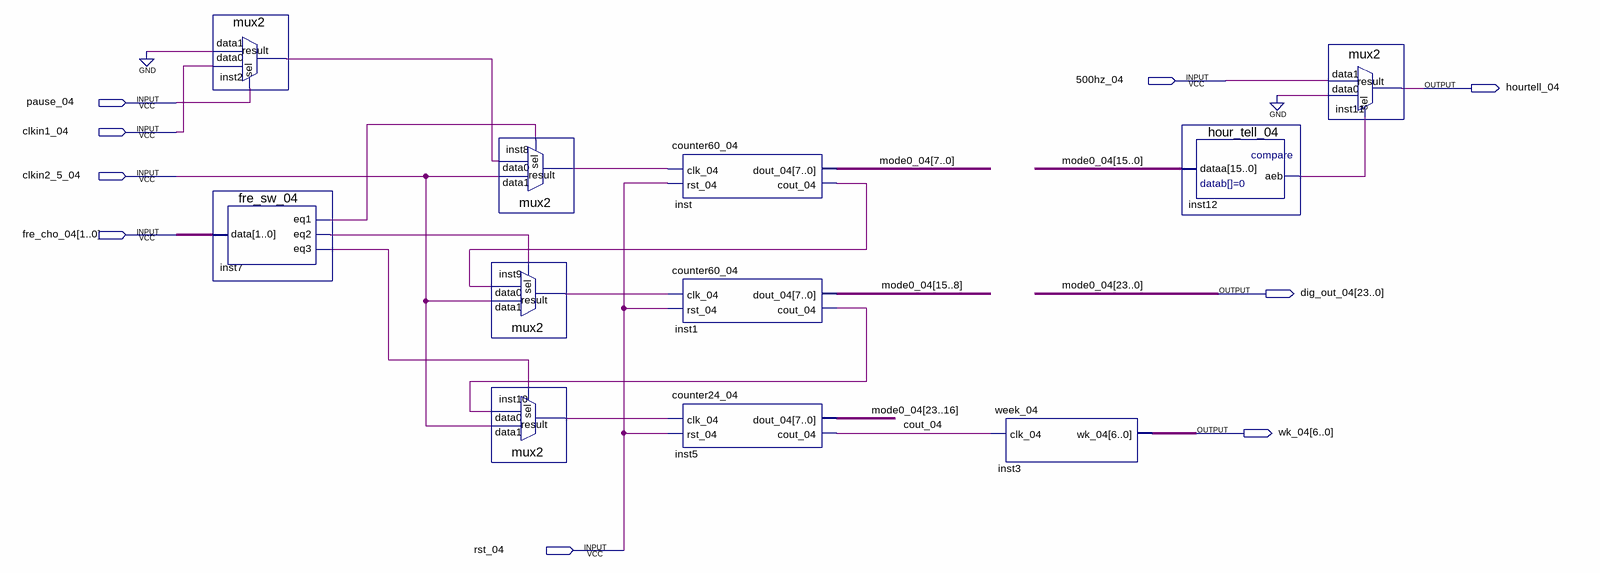
[diagram p0: schematic sheet]
// Quartus schematic clock_time_04.bdf as structural Verilog: 11 symbols, 9 pins
module clock_time_04 (
  input  \500hz_04 ,
  input  pause_04,
  input  clkin1_04,
  input  clkin2_5_04,
  input  [1:0] fre_cho_04,
  input  rst_04,
  output hourtell_04,
  output [23:0] dig_out_04,
  output [6:0] wk_04
);

  wire cout_04, inst1_cout_04, inst2_result, inst7_eq1, inst7_eq2, inst7_eq3, inst8_result, inst9_result,
       inst10_result, inst12_aeb, inst_cout_04;

  mux2 inst2 (.data1(1'b0), .data0(clkin1_04), .sel(pause_04), .result(inst2_result));
  fre_sw_04 inst7 (.data(fre_cho_04), .eq1(inst7_eq1), .eq2(inst7_eq2), .eq3(inst7_eq3));
  mux2 inst8 (.data1(clkin2_5_04), .data0(inst2_result), .sel(inst7_eq1), .result(inst8_result));
  mux2 inst9 (.data1(clkin2_5_04), .data0(inst_cout_04), .sel(inst7_eq2), .result(inst9_result));
  mux2 inst10 (.data1(clkin2_5_04), .data0(inst1_cout_04), .sel(inst7_eq3), .result(inst10_result));
  counter60_04 inst (.clk_04(inst8_result), .rst_04(rst_04), .dout_04(dig_out_04[7:0]), .cout_04(inst_cout_04));
  counter60_04 inst1 (.clk_04(inst9_result), .rst_04(rst_04), .dout_04(dig_out_04[15:8]), .cout_04(inst1_cout_04));
  counter24_04 inst5 (.clk_04(inst10_result), .rst_04(rst_04), .dout_04(dig_out_04[23:16]), .cout_04(cout_04));
  week_04 inst3 (.clk_04(cout_04), .wk_04(wk_04));
  hour_tell_04 inst12 (.dataa(dig_out_04[15:0]), .aeb(inst12_aeb));
  mux2 inst11 (.data1(\500hz_04 ), .data0(1'b0), .sel(inst12_aeb), .result(hourtell_04));

  // Other names for the same wires on the sheet: mode0_04[23:0] = dig_out_04
endmodule
